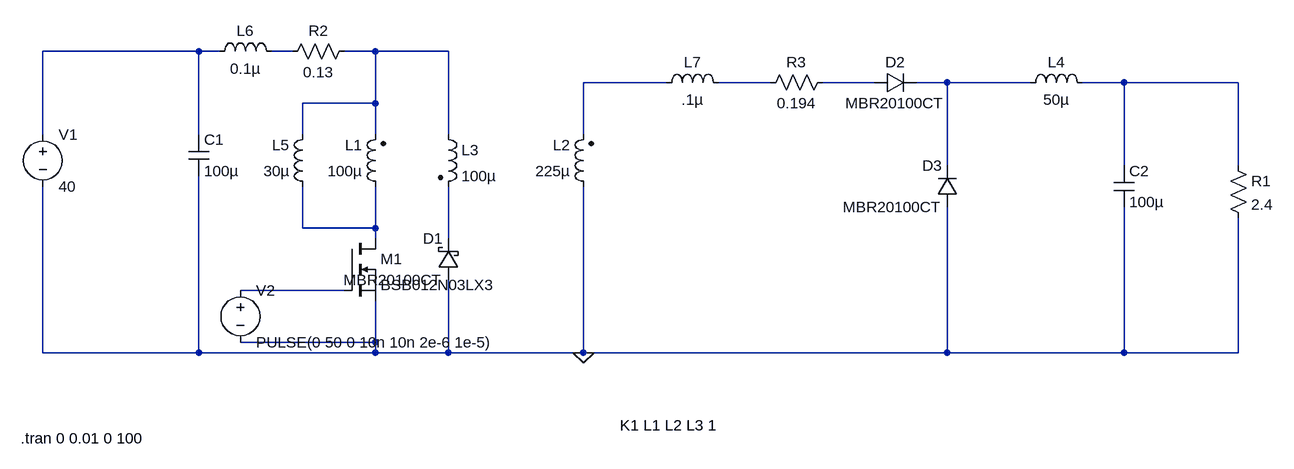
[diagram p0: schematic Converter.asc]
Converter.asc, the LTspice schematic file:
Version 4
SHEET 1 1164 680
WIRE -496 32 -736 32
WIRE -464 32 -496 32
WIRE -352 32 -384 32
WIRE -224 32 -272 32
WIRE -112 32 -224 32
WIRE 224 80 96 80
WIRE 384 80 304 80
WIRE 544 80 464 80
WIRE 656 80 608 80
WIRE 784 80 656 80
WIRE 928 80 864 80
WIRE 1104 80 928 80
WIRE -224 112 -224 32
WIRE -224 112 -336 112
WIRE -736 160 -736 32
WIRE -496 160 -496 32
WIRE -336 160 -336 112
WIRE -224 160 -224 112
WIRE -112 160 -112 32
WIRE 96 160 96 80
WIRE 656 208 656 80
WIRE 928 208 928 80
WIRE 1104 208 1104 80
WIRE -336 304 -336 240
WIRE -224 304 -224 240
WIRE -224 304 -336 304
WIRE -224 320 -224 304
WIRE -112 320 -112 240
WIRE -272 400 -432 400
WIRE -224 480 -224 416
WIRE -224 480 -432 480
WIRE -736 496 -736 240
WIRE -496 496 -496 224
WIRE -496 496 -736 496
WIRE -224 496 -224 480
WIRE -224 496 -496 496
WIRE -112 496 -112 384
WIRE -112 496 -224 496
WIRE 96 496 96 240
WIRE 96 496 -112 496
WIRE 656 496 656 272
WIRE 656 496 96 496
WIRE 928 496 928 272
WIRE 928 496 656 496
WIRE 1104 496 1104 288
WIRE 1104 496 928 496
FLAG 96 496 0
SYMBOL ind2 -208 256 R180
WINDOW 0 36 80 Left 2
WINDOW 3 36 40 Left 2
SYMATTR InstName L1
SYMATTR Value 100µ
SYMATTR Type ind
SYMBOL ind2 112 256 R180
WINDOW 0 36 80 Left 2
WINDOW 3 36 40 Left 2
SYMATTR InstName L2
SYMATTR Value 225µ
SYMATTR Type ind
SYMBOL ind2 -128 144 R0
SYMATTR InstName L3
SYMATTR Value 100µ
SYMATTR Type ind
SYMBOL voltage -736 144 R0
SYMATTR InstName V1
SYMATTR Value 40
SYMBOL cap -512 160 R0
SYMATTR InstName C1
SYMATTR Value 100µ
SYMBOL nmos -272 320 R0
SYMATTR InstName M1
SYMATTR Value BSB012N03LX3
SYMBOL schottky -96 384 R180
WINDOW 0 24 64 Left 2
WINDOW 3 24 0 Left 2
SYMATTR InstName D1
SYMATTR Value MBR20100CT
SYMATTR Description Diode
SYMATTR Type diode
SYMBOL diode 544 96 R270
WINDOW 0 32 32 VTop 2
WINDOW 3 0 32 VBottom 2
SYMATTR InstName D2
SYMATTR Value MBR20100CT
SYMBOL diode 672 272 R180
WINDOW 0 24 64 Left 2
WINDOW 3 24 0 Left 2
SYMATTR InstName D3
SYMATTR Value MBR20100CT
SYMBOL ind 768 96 R270
WINDOW 0 32 56 VTop 2
WINDOW 3 5 56 VBottom 2
SYMATTR InstName L4
SYMATTR Value 50µ
SYMBOL cap 912 208 R0
SYMATTR InstName C2
SYMATTR Value 100µ
SYMBOL res 1088 192 R0
SYMATTR InstName R1
SYMATTR Value 2.4
SYMBOL voltage -432 384 R0
WINDOW 123 0 0 Left 0
WINDOW 39 0 0 Left 0
SYMATTR InstName V2
SYMATTR Value PULSE(0 50 0 10n 10n 2e-6 1e-5)
SYMBOL ind -320 256 R180
WINDOW 0 36 80 Left 2
WINDOW 3 36 40 Left 2
SYMATTR InstName L5
SYMATTR Value 30µ
SYMBOL ind -480 48 R270
WINDOW 0 32 56 VTop 2
WINDOW 3 5 56 VBottom 2
SYMATTR InstName L6
SYMATTR Value 0.1µ
SYMBOL res -256 16 R90
WINDOW 0 0 56 VBottom 2
WINDOW 3 32 56 VTop 2
SYMATTR InstName R2
SYMATTR Value 0.13
SYMBOL ind 208 96 R270
WINDOW 0 32 56 VTop 2
WINDOW 3 5 56 VBottom 2
SYMATTR InstName L7
SYMATTR Value .1µ
SYMBOL res 480 64 R90
WINDOW 0 0 56 VBottom 2
WINDOW 3 32 56 VTop 2
SYMATTR InstName R3
SYMATTR Value 0.194
TEXT 152 608 Left 2 !K1 L1 L2 L3 1
TEXT -770 628 Left 2 !.tran 0 0.01 0 100

The netlist it stands for:
* Converter.asc
L1 N009 N003 100µ
L2 0 N004 225µ
L3 N003 N010 100µ
V1 N001 0 40
C1 N001 0 100µ
M1 N009 N011 0 0 BSB012N03LX3
D1 0 N010 MBR20100CT
D2 N006 N007 MBR20100CT
D3 0 N007 MBR20100CT
L4 N007 N008 50µ
C2 N008 0 100µ
R1 N008 0 2.4
V2 N011 0 PULSE(0 50 0 10n 10n 2e-6 1e-5)
L5 N009 N003 30µ
L6 N001 N002 0.1µ
R2 N003 N002 0.13
L7 N004 N005 .1µ
R3 N006 N005 0.194
.model D D
.lib standard.dio
.model NMOS NMOS
.model PMOS PMOS
.lib standard.mos
K1 L1 L2 L3 1
.tran 0 0.01 0 100
.backanno
.end